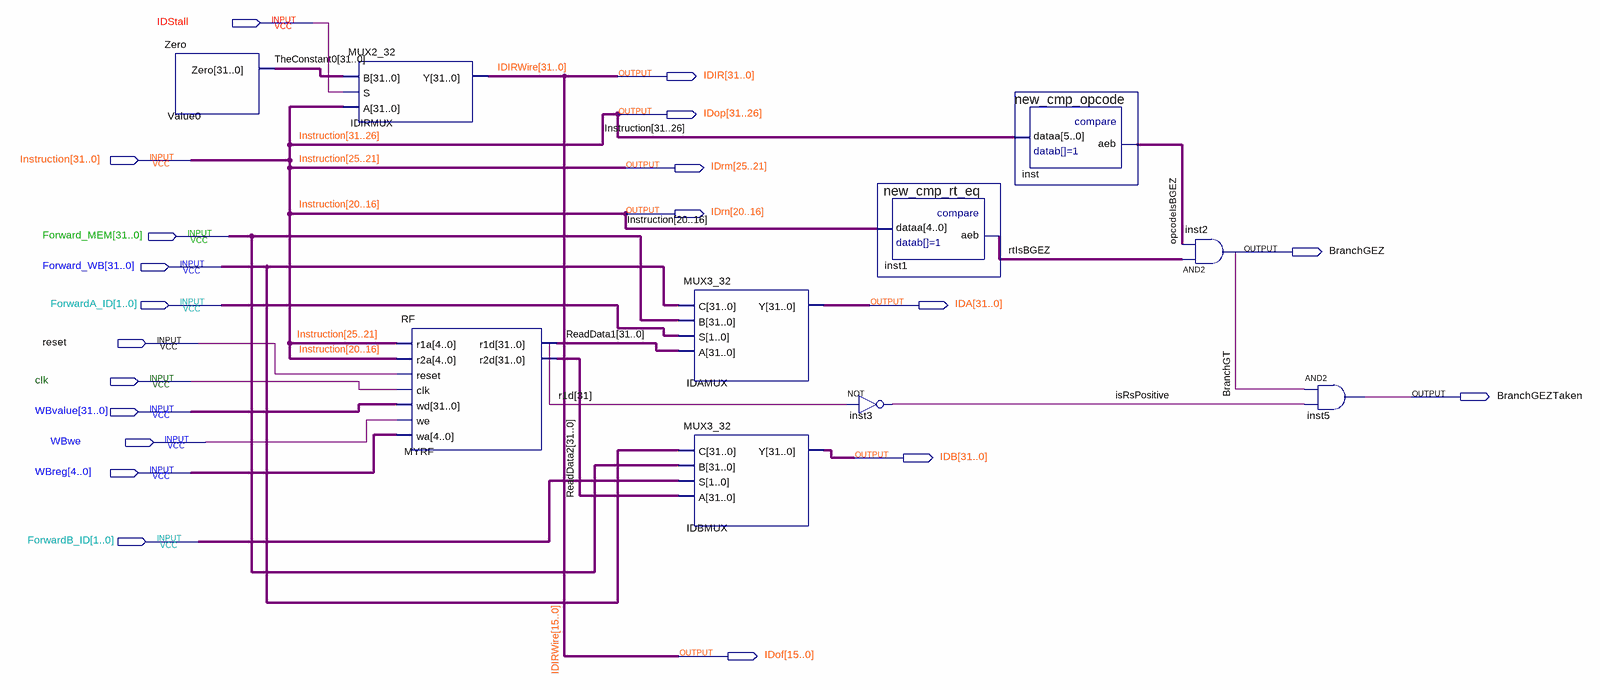
[diagram p0: schematic sheet]
// Quartus schematic ID - Copy.bdf as structural Verilog: 10 symbols, 20 pins
module \ID_-_Copy  (
  input  IDStall,
  input  [31:0] Instruction,
  input  [31:0] Forward_MEM,
  input  [31:0] Forward_WB,
  input  [1:0] ForwardA_ID,
  input  reset,
  input  clk,
  input  [31:0] WBvalue,
  input  WBwe,
  input  [4:0] WBreg,
  input  [1:0] ForwardB_ID,
  output [31:0] IDIR,
  output [31:26] IDop,
  output [25:21] IDrm,
  output [20:16] IDrn,
  output BranchGEZ,
  output [31:0] IDA,
  output BranchGEZTaken,
  output [31:0] IDB,
  output [15:0] IDof
);

  wire BranchGT, isRsPositive, opcodeIsBGEZ, rtIsBGEZ;
  wire [31:0] ReadData1, ReadData2, TheConstant0;
  wire [31:31] r1d;

  Zero Value0 (.Zero(TheConstant0));
  MUX2_32 IDIRMUX (.B(TheConstant0), .S(IDStall), .A(Instruction), .Y(IDIR));
  RF MYRF (
    .r1a(Instruction[25:21]), .r2a(Instruction[20:16]), .reset(reset), .clk(clk), .wd(WBvalue), .we(WBwe),
    .wa(WBreg), .r1d(ReadData1), .r2d(ReadData2));
  MUX3_32 IDAMUX (.C(Forward_WB), .B(Forward_MEM), .S(ForwardA_ID), .A(ReadData1), .Y(IDA));
  MUX3_32 IDBMUX (.C(Forward_WB), .B(Forward_MEM), .S(ForwardB_ID), .A(ReadData2), .Y(IDB));
  not inst3 (isRsPositive, r1d[31]);
  new_cmp_rt_eq inst1 (.dataa(Instruction[20:16]), .aeb(rtIsBGEZ));
  new_cmp_opcode inst (.dataa(Instruction[31:26]), .aeb(opcodeIsBGEZ));
  and inst2 (BranchGEZ, rtIsBGEZ, opcodeIsBGEZ);
  and inst5 (BranchGEZTaken, BranchGT, isRsPositive);

  assign IDof = IDIR[15:0];
  assign IDop = Instruction[31:26];
  assign IDrm = Instruction[25:21];
  assign IDrn = Instruction[20:16];

  // Other names for the same wires on the sheet: IDIRWire[31:0] = IDIR
endmodule
